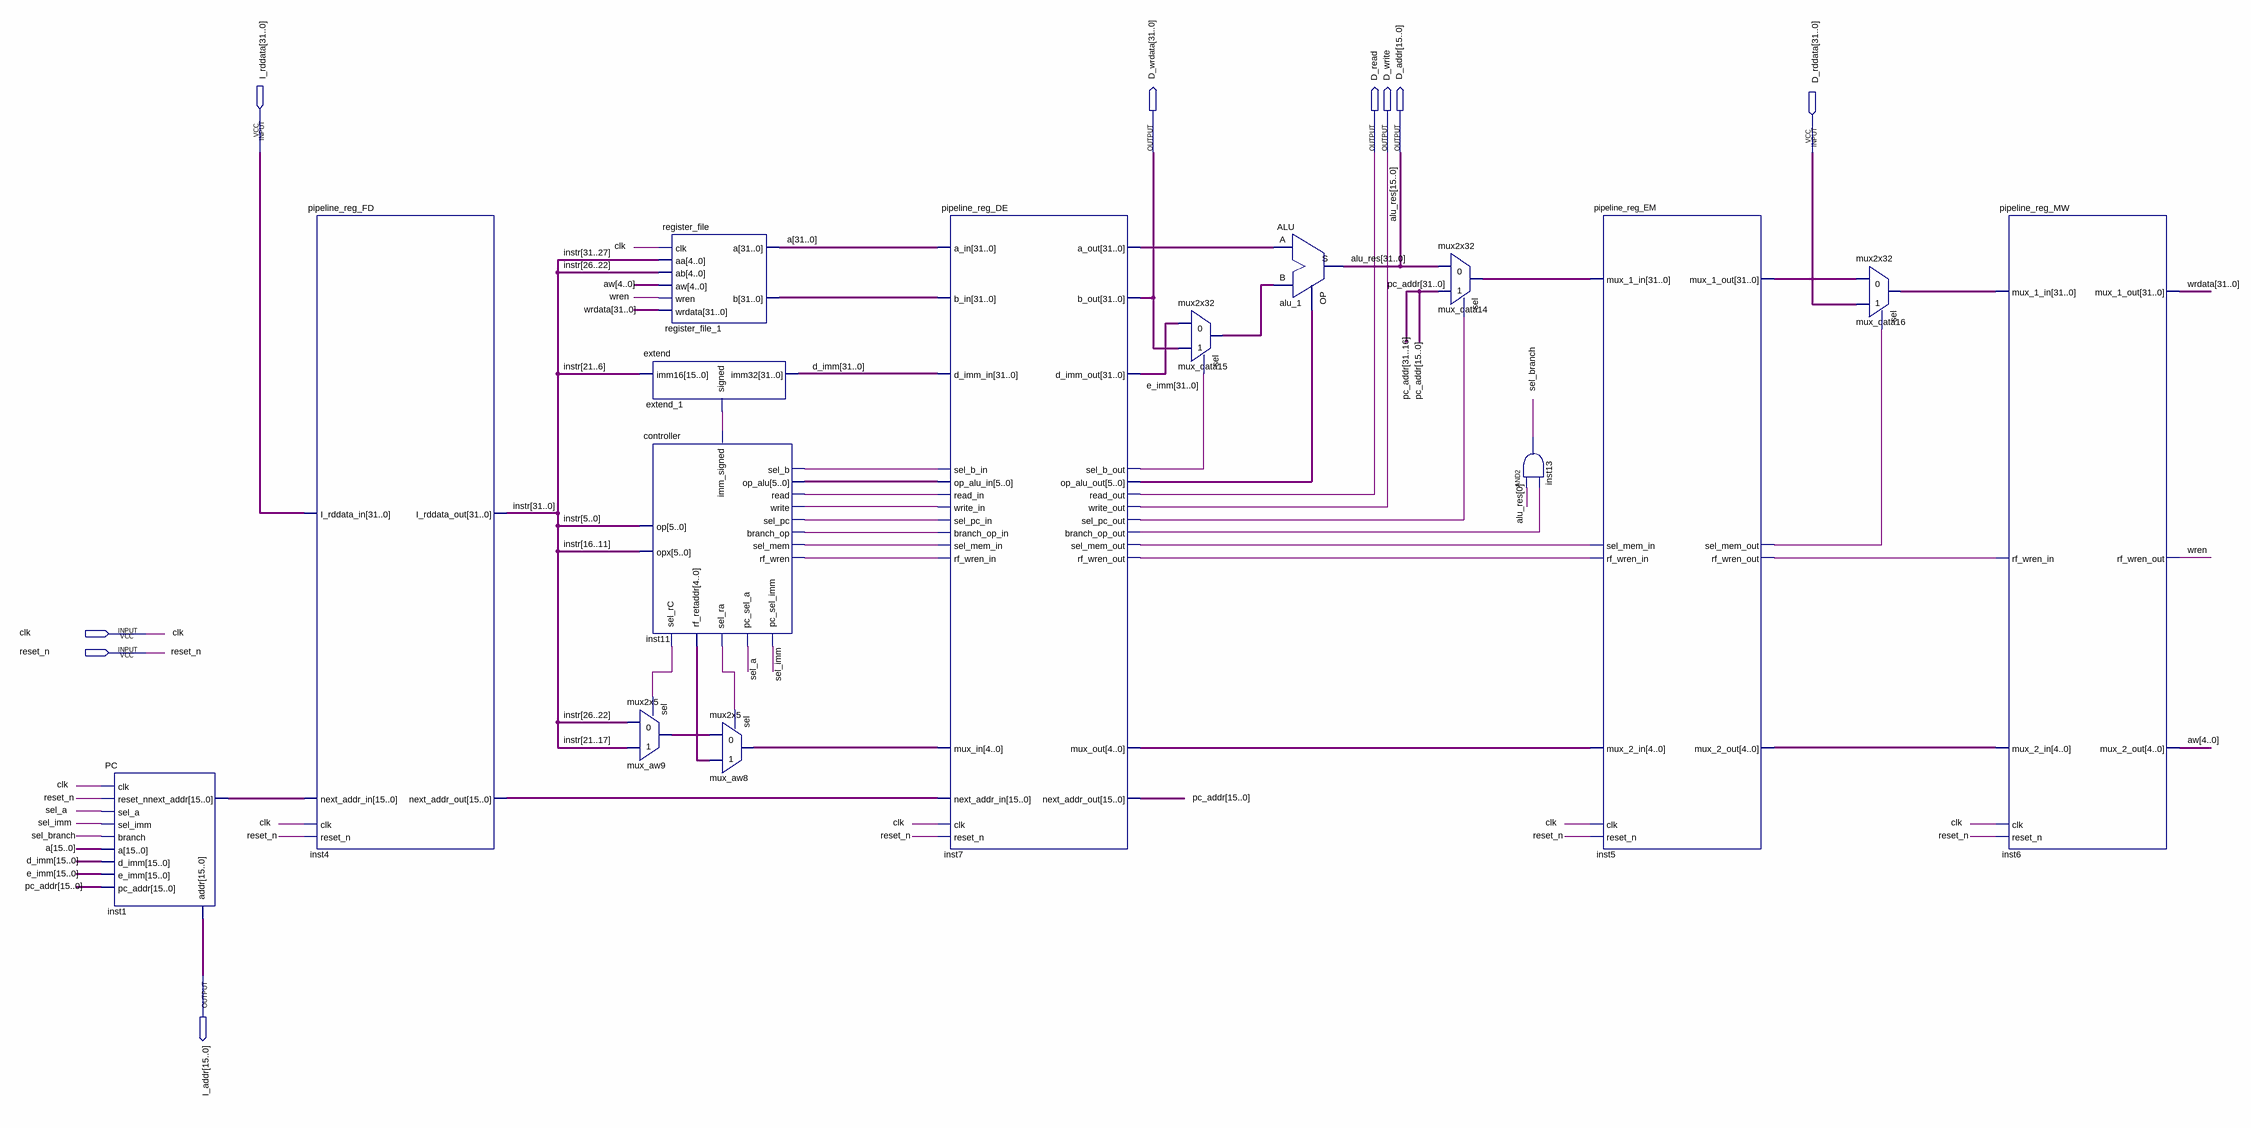
[diagram p0: schematic sheet]
// Quartus schematic CPU.bdf as structural Verilog: 15 symbols, 9 pins
module CPU (
  input  [31:0] I_rddata,
  input  [31:0] D_rddata,
  input  clk,
  input  reset_n,
  output [31:0] D_wrdata,
  output D_read,
  output D_write,
  output [15:0] D_addr,
  output [15:0] I_addr
);

  wire inst5_rf_wren_out, inst5_sel_mem_out, inst7_branch_op_out, inst7_rf_wren_out, inst7_sel_b_out,
       inst7_sel_mem_out, inst7_sel_pc_out, inst11_branch_op, inst11_imm_signed, inst11_read, inst11_rf_wren,
       inst11_sel_b, inst11_sel_mem, inst11_sel_pc, inst11_sel_ra, inst11_sel_rc, inst11_write, sel_a,
       sel_branch, sel_imm, wren;
  wire [4:0] aw, inst5_mux_2_out, inst7_mux_out, inst11_rf_retaddr, mux_aw8_o, mux_aw9_o;
  wire [5:0] inst7_op_alu_out, inst11_op_alu;
  wire [15:0] inst1_next_addr, inst4_next_addr_out;
  wire [31:0] a, d_imm, e_imm, inst5_mux_1_out, inst7_a_out, instr, mux_data14_o, mux_data15_o, mux_data16_o,
       pc_addr, register_file_1_b, wrdata;
  wire [31:16] alu_res;

  PC inst1 (
    .clk(clk), .reset_n(reset_n), .sel_a(sel_a), .sel_imm(sel_imm), .branch(sel_branch), .a(a[15:0]),
    .d_imm(d_imm[15:0]), .e_imm(e_imm[15:0]), .pc_addr(pc_addr[15:0]), .addr(I_addr),
    .next_addr(inst1_next_addr));
  pipeline_reg_FD inst4 (
    .clk(clk), .reset_n(reset_n), .I_rddata_in(I_rddata), .next_addr_in(inst1_next_addr),
    .I_rddata_out(instr), .next_addr_out(inst4_next_addr_out));
  mux2x5 mux_aw9 (.i0(instr[26:22]), .i1(instr[21:17]), .sel(inst11_sel_rc), .o(mux_aw9_o));
  register_file register_file_1 (
    .clk(clk), .aa(instr[31:27]), .ab(instr[26:22]), .aw(aw), .wren(wren), .wrdata(wrdata), .a(a),
    .b(register_file_1_b));
  extend extend_1 (.imm16(instr[21:6]), .\signed (inst11_imm_signed), .imm32(d_imm));
  controller inst11 (
    .op(instr[5:0]), .opx(instr[16:11]), .imm_signed(inst11_imm_signed), .sel_b(inst11_sel_b),
    .op_alu(inst11_op_alu), .read(inst11_read), .write(inst11_write), .sel_pc(inst11_sel_pc),
    .branch_op(inst11_branch_op), .sel_mem(inst11_sel_mem), .rf_wren(inst11_rf_wren), .pc_sel_imm(sel_imm),
    .pc_sel_a(sel_a), .sel_ra(inst11_sel_ra), .rf_retaddr(inst11_rf_retaddr), .sel_rC(inst11_sel_rc));
  mux2x5 mux_aw8 (.i0(mux_aw9_o), .i1(inst11_rf_retaddr), .sel(inst11_sel_ra), .o(mux_aw8_o));
  pipeline_reg_DE inst7 (
    .clk(clk), .reset_n(reset_n), .a_in(a), .b_in(register_file_1_b), .d_imm_in(d_imm),
    .sel_b_in(inst11_sel_b), .op_alu_in(inst11_op_alu), .read_in(inst11_read), .write_in(inst11_write),
    .sel_pc_in(inst11_sel_pc), .branch_op_in(inst11_branch_op), .sel_mem_in(inst11_sel_mem),
    .rf_wren_in(inst11_rf_wren), .mux_in(mux_aw8_o), .next_addr_in(inst4_next_addr_out), .a_out(inst7_a_out),
    .b_out(D_wrdata), .d_imm_out(e_imm), .sel_b_out(inst7_sel_b_out), .op_alu_out(inst7_op_alu_out),
    .read_out(D_read), .write_out(D_write), .sel_pc_out(inst7_sel_pc_out),
    .branch_op_out(inst7_branch_op_out), .sel_mem_out(inst7_sel_mem_out), .rf_wren_out(inst7_rf_wren_out),
    .mux_out(inst7_mux_out), .next_addr_out(pc_addr[15:0]));
  mux2x32 mux_data15 (.i0(e_imm), .i1(D_wrdata), .sel(inst7_sel_b_out), .o(mux_data15_o));
  ALU alu_1 (.a(inst7_a_out), .b(mux_data15_o), .op(inst7_op_alu_out), .s({alu_res, D_addr}));
  mux2x32 mux_data14 (.i0({alu_res, D_addr}), .i1(pc_addr), .sel(inst7_sel_pc_out), .o(mux_data14_o));
  and inst13 (sel_branch, D_addr[0], inst7_branch_op_out);
  pipeline_reg_EM inst5 (
    .clk(clk), .reset_n(reset_n), .mux_1_in(mux_data14_o), .sel_mem_in(inst7_sel_mem_out),
    .rf_wren_in(inst7_rf_wren_out), .mux_2_in(inst7_mux_out), .mux_1_out(inst5_mux_1_out),
    .sel_mem_out(inst5_sel_mem_out), .rf_wren_out(inst5_rf_wren_out), .mux_2_out(inst5_mux_2_out));
  mux2x32 mux_data16 (.i0(inst5_mux_1_out), .i1(D_rddata), .sel(inst5_sel_mem_out), .o(mux_data16_o));
  pipeline_reg_MW inst6 (
    .clk(clk), .reset_n(reset_n), .mux_1_in(mux_data16_o), .rf_wren_in(inst5_rf_wren_out),
    .mux_2_in(inst5_mux_2_out), .mux_1_out(wrdata), .rf_wren_out(wren), .mux_2_out(aw));

  // Other names for the same wires on the sheet: alu_res[15:0] = D_addr
endmodule
